# Altium project HV_Module_2W.PrjPCB (part 2 of 2)

## Sheet HV_PWR_STAGE.SchDoc: HV_Module
size 420 x 297 mm; EDA_Number: ARTIQ; Projet: HV_Module; Author: G.Kasprowicz; CompanyName: WUT ISE; DrawnBy: G.Kasprowicz; Organization: WUT ISE; Address1: PW ISE; Address2: Nowowiejska 15/19 00-665 Warsaw; Address3: gkasprow@gmail.com; DocumentNumber: 4; Revision: 1.0; SheetNumber: 4; SheetTotal: 6; ModifiedBy: -; CheckedDate: -; Title2: HV_PWR_Stage; DivGrp: WUT ISE; Designer: G.Kasprowicz; ModifiedDate: -; ProjectName: Sensor Box
Used 2 times, as channels U_HV_PWR_STAGE1, U_HV_PWR_STAGE2. Parts and nets are listed once, with the designators drawn on the sheet.
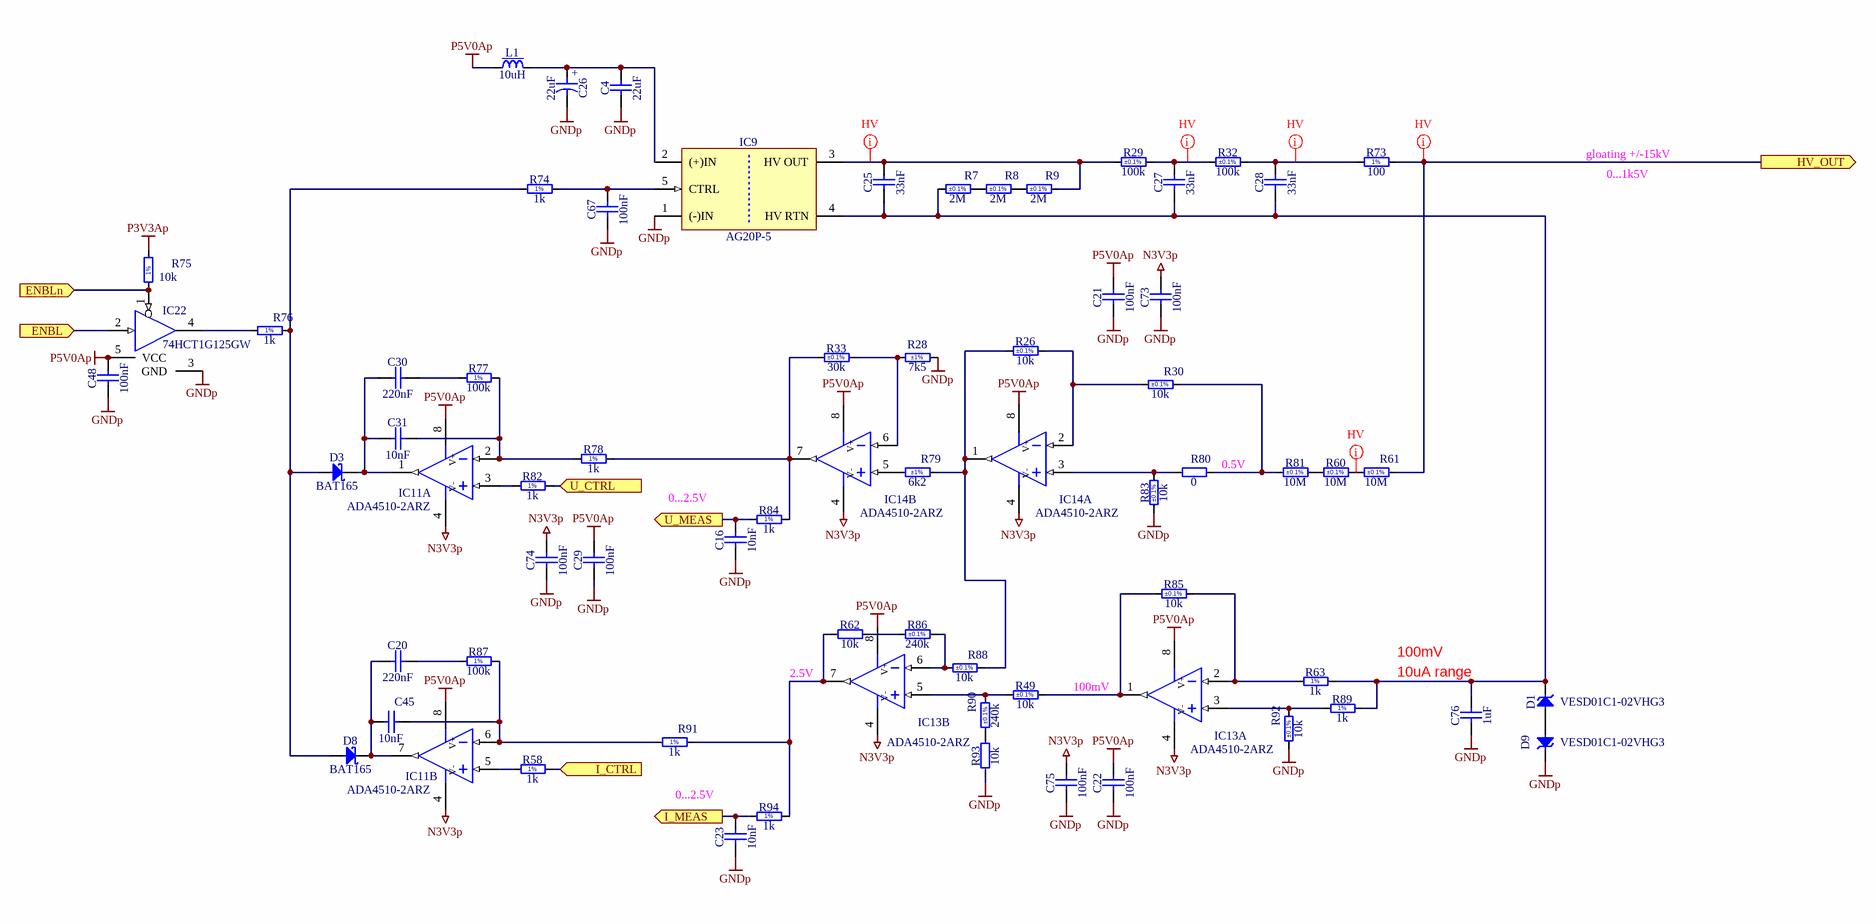
[diagram p3: HV_PWR_STAGE.SchDoc]

### Parts
C4  22uF  [CAPC3216X180N]
C16  10nF  [CAPC1005X55N]
C20  220nF  [CAPC1608X87N]
C21  100nF  [CAPC1005X55N]
C22  100nF  [CAPC1005X55N]
C23  10nF  [CAPC1005X55N]
C25  33nF  [CAPC5764X279N]
C26  22uF  [CAPMP3528X210N]
C27  33nF  [CAPC5764X279N]
C28  33nF  [CAPC5764X279N]
C29  100nF  [CAPC1005X55N]
C30  220nF  [CAPC1608X87N]
C31  10nF  [CAPC1608X87N]
C45  10nF  [CAPC1608X87N]
C48  100nF  [CAPC1005X55N]
C67  100nF  [CAPC1005X55N]
C73  100nF  [CAPC1005X55N]
C74  100nF  [CAPC1005X55N]
C75  100nF  [CAPC1005X55N]
C76  1uF  [CAPC1608X87N]
D1  VESD01C1-02VHG3  [SODFL1608X70N]
D3  BAT165  [SOD2512X110N]
D8  BAT165  [SOD2512X110N]
D9  VESD01C1-02VHG3  [SODFL1608X70N]
IC9  AG20P-5  [DCDC_XPPOWER_AG0-2KV]
IC11  ADA4510-2ARZ  [SOIC127P600X175-8N]  (parts A,B of 2)
IC13  ADA4510-2ARZ  [SOIC127P600X175-8N]  (parts A,B of 2)
IC14  ADA4510-2ARZ  [SOIC127P600X175-8N]  (parts A,B of 2)
IC22  74HCT1G125GW  [SOT65P210X110-5N]
L1  10uH  [IND_BOURNS_PM43]
R7  2M  Tolerance: ±0.1%  [RESC5025X65N]
R8  2M  Tolerance: ±0.1%  [RESC5025X65N]
R9  2M  Tolerance: ±0.1%  [RESC5025X65N]
R26  10k  Tolerance: ±0.1%  [RESC1608X55N]
R28  7k5  Tolerance: ±1%  [RESC1608X55N]
R29  100k  Tolerance: ±0.1%  [RESC3216X50N]
R30  10k  Tolerance: ±0.1%  [RESC1608X55N]
R32  100k  Tolerance: ±0.1%  [RESC3216X50N]
R33  30k  Tolerance: ±0.1%  [RESC1608X55N]
R49  10k  Tolerance: ±0.1%  [RESC1608X55N]
R58  1k  [RESC1005X40N]
R60  10M  Tolerance: ±0.1%  [RESC5025X65N]
R61  10M  Tolerance: ±0.1%  [RESC5025X65N]
R62  10k  [RESC1005X40N]
R63  1k  [RESC1005X40N]
R73  100  [RESC6331X70N]
R74  1k  [RESC1608X55N]
R75  10k  [RESC1005X40N]
R76  1k  [RESC1005X40N]
R77  100k  [RESC1608X55N]
R78  1k  [RESC1005X40N]
R79  6k2  Tolerance: ±1%  [RESC1608X55N]
R80  0  [RESC1005X40N]
R81  10M  Tolerance: ±0.1%  [RESC5025X65N]
R82  1k  [RESC1005X40N]
R83  10k  Tolerance: ±0.1%  [RESC1608X55N]
R84  1k  [RESC1005X40N]
R85  10k  Tolerance: ±0.1%  [RESC1608X55N]
R86  240k  Tolerance: ±0.1%  [RESC1608X55N]
R87  100k  [RESC1608X55N]
R88  10k  Tolerance: ±0.1%  [RESC1608X55N]
R89  1k  [RESC1005X40N]
R90  240k  Tolerance: ±0.1%  [RESC1608X55N]
R91  1k  [RESC1005X40N]
R92  10k  Tolerance: ±0.1%  [RESC1608X55N]
R93  10k  [RESC1005X40N]
R94  1k  [RESC1005X40N]

### Ports
ENBL (in), ENBLn (in), HV_OUT (out), I_CTRL (in), I_MEAS (out), U_CTRL (in), U_MEAS (out)

### Nets
GNDp: C4.1 C16.1 C21.1 C22.1 C23.1 C26.2 C29.1 C48.1 C67.1 C73.1 C74.1 C75.1 C76.1 D9.1(C) IC9.1((-)IN) IC22.3(GND) R28.2 R83.1 R92.1 R93.1
N3V3p: C73.2 C74.2 C75.2 IC11.4(V-) IC13.4(V-) IC14.4(V-)
P3V3Ap: R75.2
P5V0Ap: C21.2 C22.2 C29.2 C48.2 IC11.8(V+) IC13.8(V+) IC14.8(V+) IC22.5(VCC) L1.1
ENBL: IC22.2(IN) ; port ENBL
ENBLn: IC22.1(~{G}) R75.1 ; port ENBLn
HV_OUT: R61.2 R73.2 ; port HV_OUT
I_CTRL: R58.2 ; port I_CTRL
I_MEAS: C23.2 R94.1 ; port I_MEAS
U_CTRL: R82.2 ; port U_CTRL
U_MEAS: C16.2 R84.1 ; port U_MEAS
NetC4_2: C4.2 C26.1 IC9.2((+)IN) L1.2
NetC20_1: C20.1 C45.1 D8.1(C) IC11.7(OUT)
NetC20_2: C20.2 R87.1
NetC25_1: C25.1 C27.1 C28.1 C76.2 D1.1(C) IC9.4(HV_RTN) R7.1 R63.2 R89.2
NetC25_2: C25.2 IC9.3(HV_OUT) R9.2 R29.1
NetC27_2: C27.2 R29.2 R32.1
NetC28_2: C28.2 R32.2 R73.1
NetC30_1: C30.1 C31.1 D3.1(C) IC11.1(OUT)
NetC30_2: C30.2 R77.1
NetC31_2: C31.2 IC11.2(IN-) R77.2 R78.1
NetC45_2: C45.2 IC11.6(IN-) R87.2 R91.1
NetC67_2: C67.2 IC9.5(CTRL) R74.2
NetD1_2: D1.2(A) D9.2(A)
NetD3_2: D3.2(A) D8.2(A) R74.1 R76.2
NetIC11_3: IC11.3(IN+) R82.1
NetIC11_5: IC11.5(IN+) R58.1
NetIC13_1: IC13.1(OUT) R49.2 R85.1
NetIC13_2: IC13.2(IN-) R63.1 R85.2
NetIC13_3: IC13.3(IN+) R89.1 R92.2
NetIC13_5: IC13.5(IN+) R49.1 R90.2
NetIC13_6: IC13.6(IN-) R86.2 R88.1
NetIC13_7: IC13.7(OUT) R62.1 R91.2 R94.2
NetIC14_1: IC14.1(OUT) R26.1 R79.2 R88.2
NetIC14_2: IC14.2(IN-) R26.2 R30.1
NetIC14_3: IC14.3(IN+) R80.1 R83.2
NetIC14_5: IC14.5(IN+) R79.1
NetIC14_6: IC14.6(IN-) R28.1 R33.2
NetIC14_7: IC14.7(OUT) R33.1 R78.2 R84.2
NetIC22_4: IC22.4(OUT) R76.1
NetR7_2: R7.2 R8.1
NetR8_2: R8.2 R9.1
NetR30_2: R30.2 R80.2 R81.1
NetR60_1: R60.1 R81.2
NetR60_2: R60.2 R61.1
NetR62_2: R62.2 R86.1
NetR90_1: R90.1 R93.2

### Channels
U_HV_PWR_STAGE1: designators end in A; ports ENBL=ENBL ENBLn=ENBLn1 HV_OUT=HV_OUT I_CTRL=DAC_I I_MEAS=ADC_I U_CTRL=DAC_U U_MEAS=U_meas1
U_HV_PWR_STAGE2: designators end in B; ports ENBL=ENBL ENBLn=ENBLn2 HV_OUT=HV_OUT I_CTRL=DAC_I I_MEAS=ADC_I U_CTRL=DAC_U U_MEAS=U_meas2

### Layout directives
net class HV: HV_OUT, NetC25A_2, NetC27A_2, NetC28A_2, NetR60A_2

### Notes on the sheet
- gloating +/-15kV
- 0...1k5V
- (near R80) 0.5V
- 0...2.5V
- 2.5V
- 100mV
- (near C76) 10uA range
- Project/Equipment
- Document
- Designer
- Drawn by
- Check.by
- Copyright WUT ISE 2020.
  This documentation describes Open Hardware and is licensed under the CERN OHL v.1.2. You may redistribute and modify this documentation under the terms of the CERN OHL v.1.2. (http://ohwr.org/CERNOHL). This documentation is distributed WITHOUT ANY EXPRESS OR IMPLIED WARRANTY, INCLUDING OF MERCHANTABILITY, SATISFACTORY QUALITY AND FITNESS FOR A PARTICULAR PURPOSE. Please see the CERN OHL v.1.2 for applicable conditions.
- Contact
- File
- Last Mod.
- Print Date
- Sheet
- Size
- A3
- of
- Rev
- (in symbol CTE3528-21_22UF_20V_10%) +
- (in symbol R0402_1K_1%_0.0625W_100PPM) 1%
- (in symbol R0402_10K_1%_0.0625W_100PPM) 1%
- (in symbol R0603_1K_1%_0.1W_100PPM) 1%
- (in symbol R0603_100K_1%_0.1W_100PPM) 1%
- (in symbol R2512_100R_1%_1.5W_100PPM_VISHAY_CRCW-HP e3) 1%

### Library data of the parts
C4 = CC1206_22UF_25V_20%_X5R: Non-polarised capacitor; Part Description: SMD Multilayer Chip Ceramic Capacitor; Manufacturer: GENERIC; Manufacturer1 Part Number: C3216X5R1E226M160AB; Voltage: 25V; TC: X5R; Tolerance: ±20%; Part Number: CC1206_22UF_25V_20%_X5R; Component Kind: Standard; Component Type: Standard; Pin Count: 2; Value: 22uF; Status: None; Manufacturer Part Number: CC1206_22UF_25V_20%_X5R; Case: 1206; Mounted: Yes; Socket: No; SMD: Yes; Sense: No; Manufacturer1 Example: TDK; Manufacturer1 ComponentHeight: 1.8mm; HelpURL: \\cern.ch\dfs\Applications\Altium\Datasheets\CC1206_X5R_TDK_C.pdf; Author: CERN DEM WB; CreateDate: 25/07/2018; LatestRevisionDate: 25/07/2018
C16 C23 = CC0402_10NF_25V_10%_X7R: Non-polarised capacitor; Part Description: SMD Multilayer Chip Ceramic Capacitor; Manufacturer: GENERIC; Manufacturer1 Part Number: C1005X7R1E103K050; Voltage: 25V; TC: X7R; Tolerance: ±10%; Part Number: CC0402_10NF_25V_10%_X7R; Component Kind: Standard; Component Type: Standard; Pin Count: 2; Value: 10nF; Status: Preferred; Manufacturer Part Number: CC0402_10NF_25V_10%_X7R; Case: 0402; Mounted: Yes; Socket: No; SMD: Yes; Sense: No; Manufacturer1 Example: TDK; Manufacturer1 ComponentHeight: 0.55mm; HelpURL: \\cern.ch\dfs\Applications\Altium\Datasheets\CC0402_X7R_TDK_C.pdf; Author: CERN DEM JLC; CreateDate: 25.10.2012; LatestRevisionDate: 25.10.2012
C20 C30 = CC0603_220NF_10V_10%_X7R: Non-polarised capacitor; Part Description: SMD Multilayer Chip Ceramic Capacitor; Manufacturer: GENERIC; Manufacturer1 Part Number: 223824615654 or CC0603KRX7R6BB224; Voltage: 10V; TC: X7R; Tolerance: ±10%; Part Number: CC0603_220NF_10V_10%_X7R; Component Kind: Standard; Component Type: Standard; Pin Count: 2; Value: 220nF; Status: Preferred; Manufacturer Part Number: CC0603_220NF_10V_10%_X7R; Case: 0603; Mounted: Yes; Socket: No; SMD: Yes; Sense: No; Manufacturer1 Example: YAGEO PHYCOMP; Manufacturer1 ComponentHeight: 0.9mm; HelpURL: \\cern.ch\dfs\Applications\Altium\Datasheets\CC0603_X7R_PHYCOMP.pdf; Author: CERN DEM JLC; CreateDate: 2012-10-25; LatestRevisionDate: 2012-10-25
C21 C22 C29 C48 C67 C73-C75 = CC0402_100NF_16V_10%_X7R: Non-polarised capacitor; Part Description: SMD Multilayer Chip Ceramic Capacitor; Manufacturer: GENERIC; Manufacturer1 Part Number: GRM155R71C104KA88D; Voltage: 16V; TC: X7R; Tolerance: ±10%; Part Number: CC0402_100NF_16V_10%_X7R; Component Kind: Standard; Component Type: Standard; Pin Count: 2; Value: 100nF; Status: Not Recommended; Manufacturer Part Number: CC0402_100NF_16V_10%_X7R; Case: 0402; Mounted: Yes; Socket: No; SMD: Yes; Sense: No; Manufacturer1 Example: MURATA; Manufacturer1 ComponentHeight: 0.55mm; HelpURL: \\cern.ch\dfs\Applications\Altium\Datasheets\CC0402_X7R_MURATA_GRM.pdf; Author: CERN DEM JLC
  C21 C22 C67: CreateDate: 2013-12-05; LatestRevisionDate: 2007-12-03
  C29 C48 C73-C75: CreateDate: 05.12.2013; LatestRevisionDate: 03.12.2007
C25 C27 C28 = CC2225_33NF_2KV_10%_X7R: Non-polarised capacitor; Part Description: High Voltage MLC Chip Capacitor; Manufacturer: GENERIC; Manufacturer1 Part Number: 2225GC333KAT1A; Voltage: 2KV; TC: X7R; Tolerance: ±10%; Part Number: CC2225_33NF_2KV_10%_X7R; Component Kind: Standard; Component Type: Standard; Pin Count: 2; Value: 33nF; Status: None; Manufacturer Part Number: CC2225_33NF_2KV_10%_X7R; Case: 2225; Mounted: Yes; Socket: No; SMD: Yes; Sense: No; Manufacturer1 Example: AVX; Manufacturer1 ComponentHeight: 2.54mm; HelpURL: \\cern.ch\dfs\Applications\Altium\Datasheets\CC2225_X7R_AVX_HV-MLC.pdf; Author: CERN DEM JMW; CreateDate: 13.07.2015; LatestRevisionDate: 13.07.2015
C26 = CTE3528-21_22UF_20V_10%: Polarised capacitor; Part Description: Solid Tantalum Chip Capacitor; Manufacturer: GENERIC; Manufacturer1 Part Number: TAJB226K020R; Voltage: 20V; Tolerance: ±10%; Part Number: CTE3528-21_22UF_20V_10%; Component Kind: Standard; Component Type: Standard; Pin Count: 2; Value: 22uF; Status: Preferred; Manufacturer Part Number: CTE3528-21_22UF_20V_10%; Case: B; Mounted: Yes; Socket: No; SMD: Yes; Sense: No; Manufacturer1 Example: AVX; Manufacturer1 ComponentHeight: 2.1mm; HelpURL: \\cern.ch\dfs\Applications\Altium\Datasheets\CTE_AVX_TAJ.pdf; Author: CERN DEM JLC; CreateDate: 03/12/2007; LatestRevisionDate: 03/12/2007
C31 C45 = CC0603_10NF_50V_5%_C0G: Non-polarised capacitor; Part Description: SMD Multilayer Chip Ceramic Capacitor; Manufacturer: GENERIC; Manufacturer1 Part Number: C1608C0G1H103J080AA; Voltage: 50V; TC: C0G/NP0; Tolerance: ±5%; Part Number: CC0603_10NF_50V_5%_C0G; Component Kind: Standard; Component Type: Standard; Pin Count: 2; Value: 10nF; Status: Preferred; Manufacturer Part Number: CC0603_10NF_50V_5%_C0G; Case: 0603; Mounted: Yes; Socket: No; SMD: Yes; Sense: No; Manufacturer1 Example: TDK; Manufacturer1 ComponentHeight: 0.9mm; HelpURL: \\cern.ch\dfs\Applications\Altium\Datasheets\CC0603_C0G_TDK_C.pdf; Author: CERN DEM JLC; CreateDate: 2014-12-10; LatestRevisionDate: 2014-12-10
C76 = CC0603_1UF_16V_10%_X7R: Non-polarised capacitor; Part Description: SMD Multilayer Chip Ceramic Capacitor; Manufacturer: GENERIC; Manufacturer1 Part Number: 223878615663; Voltage: 16V; TC: X7R; Tolerance: ±10%; Part Number: CC0603_1UF_16V_10%_X7R; Component Kind: Standard; Component Type: Standard; Pin Count: 2; Value: 1uF; Status: None; Manufacturer Part Number: CC0603_1UF_16V_10%_X7R; Case: 0603; Mounted: Yes; Socket: No; SMD: Yes; Sense: No; Manufacturer1 Example: YAGEO PHYCOMP; Manufacturer1 ComponentHeight: 0.9mm; HelpURL: \\cern.ch\dfs\Applications\Altium\Datasheets\CC0603_X7R_PHYCOMP.pdf; Author: CERN DEM JLC; CreateDate: 03.12.2007; LatestRevisionDate: 17.04.2015
D1 D9 = VESD01C1-02VHG3: Transient Voltage Suppressor Diode (Uni-Directional); Part Description: Single-Line ESD-Protection (30kV) Diode; Manufacturer: VISHAY SEMICONDUCTORS; Voltage: 1V; Power: 100W; PressFit: No; Bonding: No; Part Number: VESD01C1-02VHG3; Component Kind: Standard; Component Type: Standard; Device: VESD01C1-02VHG3; PackageDescription: SODFL (SOD-523) Diode; 1.20mm W X 0.80mm L X 0.70mm H body, IPC Medium Density; Manufacturer Part Number: VESD01C1-02VHG3; Pin Count: 2; Case: SOD-523; Mounted: Yes; Socket: No; SMD: Yes; Sense: No; ComponentHeight: 0.7mm; HelpURL: \\cern.ch\dfs\Applications\Altium\Datasheets\VESD01C1-02VHG3.pdf; Author: CERN DEM BC; CreateDate: 19.05.2020; LatestRevisionDate: 19.05.2020
D3 D8 = BAT165: Schottky Diode; Part Description: Medium Power AF Schottky Diode; Manufacturer: INFINEON; Voltage: 40V; Power: 750mA; PressFit: No; Bonding: No; Part Number: BAT165; Component Kind: Standard; Component Type: Standard; Device: BAT165; PackageDescription: Small Outline Diode (SOD-323), 1.70mm W X 1.25mm L X 1.10mm H body,  IPC Medium Density; Manufacturer Part Number: BAT165; Pin Count: 2; Case: SOD-323; Mounted: Yes; Socket: No; SMD: Yes; Sense: No; ComponentHeight: 1.1mm; HelpURL: \\cern.ch\dfs\Applications\Altium\Datasheets\BAT165.pdf; Author: CERN DEM JLC; CreateDate: 12.11.2014; LatestRevisionDate: 12.11.2014
IC9 = AG20P-5: XP POWER, AG Series, DC/HVDC Converter; Part Description: 5VDC to 0-2kVDC, Iout (max) 0.5mA, 1W DC-HVDC Converter; PressFit: No; Bonding: No; Part Number: AG20P-5; Component Kind: Standard; Component Type: Standard; Device: AG20P-5; PackageDescription: AG Series, DC/HVDC Converter, Body W 11.43mm x L 23.37mm x H 6.35mm; Manufacturer: XP POWER; Manufacturer Part Number: AG20P-5; Pin Count: 5; Mounted: Yes; Socket: No; SMD: Yes; Sense: No; ComponentHeight: 3.3mm; HelpURL: \\cern.ch\dfs\Applications\Altium\Datasheets\XPPOWER_AG-Series.pdf; Author: CERN DEM BC; CreateDate: 18.09.2020; LatestRevisionDate: 18.09.2020
IC11 IC13 IC14 = OA_ADA4510-2ARZ: Precision, 40 V, ±70 nV/°C, Rail-to-Rail Input and Output Op Amp with DigiTrim; Part Description: 40V, EMI Enhanced, Zero Drift, Ultralow Noise, Dual Rail-to-Rail Output Operational Amplifier; Manufacturer: ANALOG DEVICES; PressFit: No; Bonding: No; Part Number: ADA4510-2ARZ; Component Kind: Standard; Component Type: Standard; Device: ADA4510-2ARZ; PackageDescription: SOIC 8, Pitch 1.27mm - Body 4x5mm, IPC Medium Density; Manufacturer Part Number: ADA4510-2ARZ; Pin Count: 8; Case: SOIC8; Mounted: Yes; Socket: No; SMD: Yes; Sense: No; ComponentHeight: 1.75mm; Author: GK; HelpURL: \\cern.ch\dfs\Applications\Altium\Datasheets\ADA4522-X.pdf; CreateDate: 05.01.2023; LatestRevisionDate: 05.01.2023
IC22 = 74HCT1G125GW: Single Bus Buffer Gate With 3-State Output; Part Description: Bus Buffer/Line Driver 3-State; Manufacturer: NEXPERIA; PressFit: No; Bonding: No; Part Number: 74HCT1G125GW; Component Kind: Standard; Component Type: Standard; Device: 74HCT1G125GW; PackageDescription: SOT353, SC70-5, 0.65mm Pitch; 5 Pin, 1.25mm W X 2.00mm L X 1.10mm H body, IPC Medium Density; Manufacturer Part Number: 74HCT1G125GW; Pin Count: 5; Case: SOT353; Mounted: Yes; Socket: No; SMD: Yes; Sense: No; ComponentHeight: 1.1mm; Author: CERN DEM JMW; HelpURL: \\cern.ch\dfs\Applications\Altium\Datasheets\74HCT1G125GW.pdf; CreateDate: 06.08.2020; LatestRevisionDate: 06.08.2020
L1 = IND_10UH_20%_BOURNS_PM43: Inductor With Core; Part Description: SMD Power Inductor; Manufacturer: BOURNS; Manufacturer Part Number: PM43-100M-RC; Power: 1.15A; Resistance: 0.18R; Tolerance: ±20%; Part Number: IND_10UH_20%_BOURNS_PM43; Component Kind: Standard; Component Type: Standard; Pin Count: 2; Value: 10uH; Status: None; Mounted: Yes; Socket: No; SMD: Yes; Sense: No; ComponentHeight: 3.5mm; HelpURL: \\cern.ch\dfs\Applications\Altium\Datasheets\IND_BOURNS_PM43.pdf; Author: CERN DEM JLC; CreateDate: 17/05/2011; LatestRevisionDate: 17/05/2011
R7-R9 = R1210_2M0_0.1%_1/3W_25ppm: RES, HV, 2010, 2 Mohm, 0.1%, 25 ppm, 1W; Part Description: Thick Film Chip Resistor; Manufacturer: Vishay Dale; Manufacturer Part Number: TNPV12102M00BEEA; Power: 1/3W; TC: ±25ppm/°C; PressFit: No; Part Number: R1210_2M0_0.1%_1/3W_25ppm; Component Kind: Standard; Component Type: Standard; Pin Count: 2; Value: 2M; Status: None; Case: 2010; Mounted: Yes; Sense: No; Socket: No; SMD: Yes; Manufacturer1 ComponentHeight: 0.65mm; HelpURL: \\cern.ch\dfs\Applications\Altium\Datasheets\R2010_WELWYN_LHVC.pdf; Author: GK; CreateDate: 26.02.2015; LatestRevisionDate: 26.02.2015
R26 R30 R49 R83 R85 R88 R92 = R0603_10K_0.1%_0.063W_10PPM: Resistor - 0.1%; Part Description: Thin Film Chip Resistor; Manufacturer: GENERIC; Manufacturer1 Part Number: RN73C1J10KBTDF; Power: 0.063W; TC: ±10ppm; PressFit: No; Part Number: R0603_10K_0.1%_0.063W_10PPM; Component Kind: Standard; Component Type: Standard; Pin Count: 2; Value: 10k; Status: Not Recommended; Manufacturer Part Number: R0603_10K_0.1%_0.063W_10PPM; Case: 0603; Mounted: Yes; Sense: No; Socket: No; SMD: Yes; Manufacturer1 Example: TYCO HOLSWORTHY; Manufacturer1 ComponentHeight: 0.5mm; HelpURL: \\cern.ch\dfs\Applications\Altium\Datasheets\R0603_Tyco_RN73.pdf; Author: CERN DEM JLC; CreateDate: 03.12.2007; LatestRevisionDate: 13.03.2008
R28 = R0603_7K5_1%_0.1W_100PPM: Resistor - 1%; Part Description: General Purpose Thick Film Chip Resistor; Manufacturer: GENERIC; Manufacturer1 Part Number: NRC06F7501TRF; Power: 0.1W; TC: ±100ppm/°C; PressFit: No; Part Number: R0603_7K5_1%_0.1W_100PPM; Component Kind: Standard; Component Type: Standard; Pin Count: 2; Value: 7k5; Status: Preferred; Manufacturer Part Number: R0603_7K5_1%_0.1W_100PPM; Case: 0603; Mounted: Yes; Sense: No; Socket: No; SMD: Yes; Manufacturer1 Example: NIC COMPONENT; Manufacturer1 ComponentHeight: 0.55mm; HelpURL: \\cern.ch\dfs\Applications\Altium\Datasheets\R0603_NIC_NRC.pdf; Author: CERN DEM JLC; CreateDate: 03.12.2007; LatestRevisionDate: 13.03.2008
R29 R32 = R1206_100K_0.1%_0.4W_25PPM_VISHAY_PAT: Resistor - 0.1%; Part Description: Precision Automotive Thin Film Chip Resistors 2kV ESD Rating; Manufacturer: VISHAY DALE THIN FILM; Manufacturer Part Number: PAT1206E1003BS; Power: 0.4W; TC: ±25ppm/°C; PressFit: No; Part Number: R1206_100K_0.1%_0.4W_25PPM_VISHAY_PAT; Component Kind: Standard; Component Type: Standard; Pin Count: 2; Value: 100k; Status: None; Case: 1206; Mounted: Yes; Sense: No; Socket: No; SMD: Yes; ComponentHeight: 0.5mm; HelpURL: \\cern.ch\dfs\Applications\Altium\Datasheets\R1206_VISHAY_PAT.pdf; Author: CERN DEM MR; CreateDate: 19.07.2016; LatestRevisionDate: 19.07.2016
R33 = R0603_30K_0.1%_0.063W_25PPM: Resistor - 0.1%; Part Description: Thin Film Chip Resistor; Manufacturer: GENERIC; Manufacturer1 Part Number: CPF0603B30KE1; Power: 0.063W; TC: ±25ppm; PressFit: No; Part Number: R0603_30K_0.1%_0.063W_25PPM; Component Kind: Standard; Component Type: Standard; Pin Count: 2; Value: 30k; Status: Not Recommended; Manufacturer Part Number: R0603_30K_0.1%_0.063W_25PPM; Case: 0603; Mounted: Yes; Sense: No; Socket: No; SMD: Yes; Manufacturer1 Example: TE CONNECTIVITY; Manufacturer1 ComponentHeight: 0.55mm; HelpURL: \\cern.ch\dfs\Applications\Altium\Datasheets\R0603_TYCO_CPF.pdf; Author: CERN DEM JMW; CreateDate: 28.07.2021; LatestRevisionDate: 28.07.2021
R58 R63 R76 R78 R82 R84 R89 R91 R94 = R0402_1K_1%_0.0625W_100PPM: Resistor - 1%; Part Description: General Purpose Thick Film Chip Resistor; Manufacturer: GENERIC; Manufacturer1 Part Number: 232270671002L; TC: ±100ppm/°C; Part Number: R0402_1K_1%_0.0625W_100PPM; Component Kind: Standard; Component Type: Standard; Pin Count: 2; Value: 1k; Status: Not recommended; Power: 0.0625W; Tolerance: ±1%; Manufacturer Part Number: R0402_1K_1%_0.0625W_100PPM; Case: 0402; Mounted: Yes; Sense: No; Socket: No; SMD: Yes; Manufacturer1 Example: YAGEO PHYCOMP; Manufacturer1 ComponentHeight: 0.4mm; HelpURL: \\cern.ch\dfs\Applications\Altium\Datasheets\R0402_Phycomp_RC0402.pdf; Author: CERN DEM JLC; CreateDate: 2007-12-03; LatestRevisionDate: 2012-10-17
R60 R61 R81 = R1210_1M0_0.1%_1W_25ppm_HVCB2010BDE10M0: RES, HV, 2010, 10 Mohm, 0.1%, 25 ppm, 1W; Part Description: Thick Film Chip Resistor; Manufacturer: Stackpole Electronics; TC: ±25ppm/°C; PressFit: No; Part Number: R1210_1M0_0.1%_1W_25ppm_HVCB2010BDE10M0; Component Kind: Standard; Component Type: Standard; Pin Count: 2; Value: 10M; Status: None; Power: 1W; Manufacturer Part Number: HVCB2010BDE10M0; Case: 2010; Mounted: Yes; Sense: No; Socket: No; SMD: Yes; Manufacturer1 ComponentHeight: 0.65mm; HelpURL: \\cern.ch\dfs\Applications\Altium\Datasheets\R2010_WELWYN_LHVC.pdf; Author: GK; CreateDate: 26.02.2015; LatestRevisionDate: 26.02.2015
R62 R93 = R0402_10K_1%_0.0625W_100PPM: Resistor - 1%; Part Description: General Purpose Thick Film Chip Resistor; Manufacturer: GENERIC; Manufacturer1 Part Number: 232270671003L; TC: ±100ppm/°C; PressFit: No; Part Number: R0402_10K_1%_0.0625W_100PPM; Component Kind: Standard; Component Type: Standard; Pin Count: 2; Value: 10k; Status: Not Recommended; Power: 0.0625W; Tolerance: ±1%; Manufacturer Part Number: R0402_10K_1%_0.0625W_100PPM; Case: 0402; Mounted: Yes; Sense: No; Socket: No; SMD: Yes; Manufacturer1 Example: YAGEO PHYCOMP; Manufacturer1 ComponentHeight: 0.4mm; HelpURL: \\cern.ch\dfs\Applications\Altium\Datasheets\R0402_Phycomp_RC0402.pdf; Author: CERN DEM JLC; CreateDate: 03.12.2007; LatestRevisionDate: 17.10.2012
R73 = R2512_100R_1%_1.5W_100PPM_VISHAY_CRCW-HP e3: Resistor - 1%; Part Description: Pulse Proof, High Power Thick Film Chip Resistor; Manufacturer: VISHAY DRALORIC; Manufacturer Part Number: CRCW2512100RFKEHHP; Power: 1.5W; TC: ±100ppm/°C; Voltage: 500V; Part Number: R2512_100R_1%_1.5W_100PPM_VISHAY_CRCW-HP e3; Component Kind: Standard; Component Type: Standard; Pin Count: 2; Value: 100; Status: None; Tolerance: ±1%; Case: 2512; Mounted: Yes; Sense: No; Socket: No; SMD: Yes; ComponentHeight: 0.7mm; HelpURL: \\cern.ch\dfs\Applications\Altium\Datasheets\R2512_VISHAY_CRCW-HP e3.pdf; Author: CERN DEM JLC; CreateDate: 2013-05-21; LatestRevisionDate: 2013-05-21
R74 = R0603_1K_1%_0.1W_100PPM: Resistor - 1%; Part Description: General Purpose Thick Film Chip Resistor; Manufacturer: GENERIC; Manufacturer1 Part Number: NRC06F1001TRF; Power: 0.1W; TC: ±100ppm/°C; PressFit: No; Part Number: R0603_1K_1%_0.1W_100PPM; Component Kind: Standard; Component Type: Standard; Pin Count: 2; Value: 1k; Status: Preferred; Tolerance: ±1%; Manufacturer Part Number: R0603_1K_1%_0.1W_100PPM; Case: 0603; Mounted: Yes; Sense: No; Socket: No; SMD: Yes; Manufacturer1 Example: NIC COMPONENT; Manufacturer1 ComponentHeight: 0.55mm; HelpURL: \\cern.ch\dfs\Applications\Altium\Datasheets\R0603_NIC_NRC.pdf; Author: CERN DEM JLC; CreateDate: 03/12/2007; LatestRevisionDate: 13/03/2008
R75 = R0402_10K_1%_0.0625W_100PPM: as R107 on sheet Isolators_HV; Part Number: R0402_10K_1%_0.0625W_100PPM; Component Kind: Standard; Component Type: Standard; Pin Count: 2; Value: 10k; Status: Not recommended; Power: 0.0625W; Tolerance: ±1%; Manufacturer Part Number: R0402_10K_1%_0.0625W_100PPM; Case: 0402; Mounted: Yes; Sense: No; Socket: No; SMD: Yes; Manufacturer1 Example: YAGEO PHYCOMP; Manufacturer1 ComponentHeight: 0.4mm; HelpURL: \\cern.ch\dfs\Applications\Altium\Datasheets\R0402_Phycomp_RC0402.pdf; Author: CERN DEM JLC; CreateDate: 2007-12-03; LatestRevisionDate: 2012-10-17
R77 R87 = R0603_100K_1%_0.1W_100PPM: Resistor - 1%; Part Description: General Purpose Thick Film Chip Resistor; Manufacturer: GENERIC; Manufacturer1 Part Number: NRC06F1003TRF; Power: 0.1W; TC: ±100ppm/°C; Part Number: R0603_100K_1%_0.1W_100PPM; Component Kind: Standard; Component Type: Standard; Pin Count: 2; Value: 100k; Status: Preferred; Tolerance: ±1%; Manufacturer Part Number: R0603_100K_1%_0.1W_100PPM; Case: 0603; Mounted: Yes; Sense: No; Socket: No; SMD: Yes; Manufacturer1 Example: NIC COMPONENT; Manufacturer1 ComponentHeight: 0.55mm; HelpURL: \\cern.ch\dfs\Applications\Altium\Datasheets\R0603_NIC_NRC.pdf; Author: CERN DEM JLC; CreateDate: 2007-12-03; LatestRevisionDate: 2008-03-13
R79 = R0603_6k2_1%_0.1W_100PPM: Resistor - 1%; Part Description: General Purpose Thick Film Chip Resistor; Manufacturer: GENERIC; Manufacturer1 Part Number: NRC06F6201TRF; Power: 0.1W; TC: ±100ppm/°C; PressFit: No; Part Number: R0603_6K2_1%_0.1W_100PPM; Component Kind: Standard; Component Type: Standard; Pin Count: 2; Value: 6k2; Status: Preferred; Manufacturer Part Number: R0603_6K2_1%_0.1W_100PPM; Case: 0603; Mounted: Yes; Sense: No; Socket: No; SMD: Yes; Manufacturer1 Example: NIC COMPONENT; Manufacturer1 ComponentHeight: 0.55mm; HelpURL: \\cern.ch\dfs\Applications\Altium\Datasheets\R0603_NIC_NRC.pdf; Author: CERN DEM JLC; CreateDate: 03.12.2007; LatestRevisionDate: 13.03.2008
R80 = R0402_0R_JUMPER: Resistor; Part Description: 1A (0.05R Max DC Resistance) Zero Ohm Jumper; Manufacturer: GENERIC; Manufacturer1 Part Number: 232270591001L; PressFit: No; Part Number: R0402_0R_JUMPER; Component Kind: Standard; Component Type: Standard; Pin Count: 2; Value: 0; Status: Not Recommended; Manufacturer Part Number: R0402_0R_JUMPER; Case: 0402; Mounted: Yes; Sense: No; Socket: No; SMD: Yes; Manufacturer1 Example: YAGEO PHYCOMP; Manufacturer1 ComponentHeight: 0.4mm; HelpURL: \\cern.ch\dfs\Applications\Altium\Datasheets\R0402_Phycomp_RC0402.pdf; Author: CERN DEM JLC; CreateDate: 03.12.2007; LatestRevisionDate: 17.10.2012
R86 R90 = R0603_240K_0.1%_0.063W_10PPM: Resistor - 0.1%; Part Description: Thin Film Chip Resistor; Manufacturer: GENERIC; Manufacturer1 Part Number: RN73C1J241KBTDF; Power: 0.063W; TC: ±10ppm; PressFit: No; Part Number: R0603_240K_0.1%_0.063W_10PPM; Component Kind: Standard; Component Type: Standard; Pin Count: 2; Value: 240k; Status: Not Recommended; Manufacturer Part Number: R0603_240K_0.1%_0.063W_10PPM; Case: 0603; Mounted: Yes; Sense: No; Socket: No; SMD: Yes; Manufacturer1 Example: TYCO HOLSWORTHY; Manufacturer1 ComponentHeight: 0.5mm; HelpURL: \\cern.ch\dfs\Applications\Altium\Datasheets\R0603_Tyco_RN73.pdf; Author: CERN DEM BC; CreateDate: 28.10.2021; LatestRevisionDate: 28.10.2021

## Sheet Supply_5V_ISOL.SchDoc: HV_Module
size 420 x 297 mm; EDA_Number: ARTIQ; Projet: HV_Module; Author: G.Kasprowicz; CompanyName: WUT ISE; DrawnBy: G.Kasprowicz; Organization: WUT ISE; Address1: PW ISE; Address2: Nowowiejska 15/19 00-665 Warsaw; Address3: gkasprow@gmail.com; DocumentNumber: 5; Revision: 1.0; SheetNumber: 5; SheetTotal: 6; ModifiedBy: -; CheckedDate: -; Title2: Supply_5V_ISOL; DivGrp: WUT ISE; Designer: G.Kasprowicz; ModifiedDate: -; ProjectName: Sensor Box
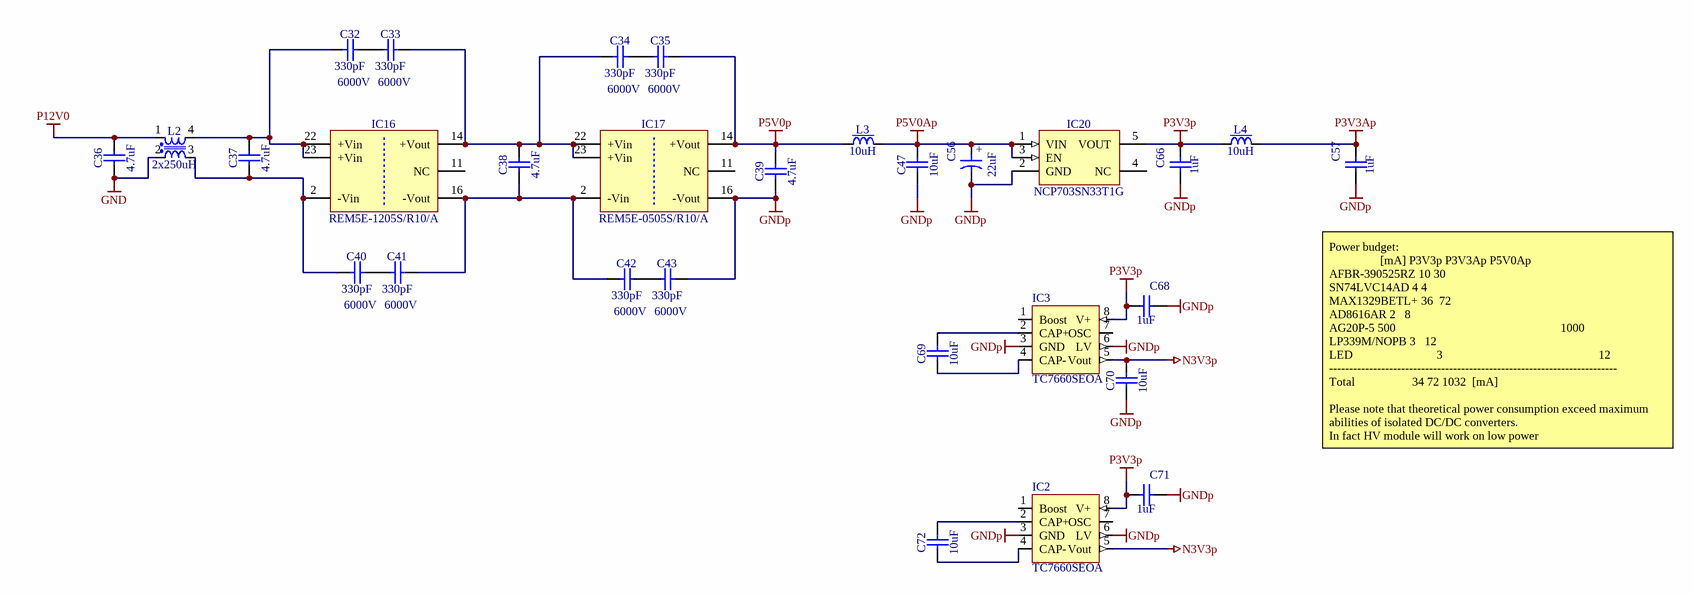
[diagram p4: Supply_5V_ISOL.SchDoc]

### Parts
C32  330pF  Voltage: 6000V  [CAPC4620X220N]
C33  330pF  Voltage: 6000V  [CAPC4620X220N]
C34  330pF  Voltage: 6000V  [CAPC4620X220N]
C35  330pF  Voltage: 6000V  [CAPC4620X220N]
C36  4.7uF  [CAPC2012X145N]
C37  4.7uF  [CAPC2012X145N]
C38  4.7uF  [CAPC2012X145N]
C39  4.7uF  [CAPC2012X145N]
C40  330pF  Voltage: 6000V  [CAPC4620X220N]
C41  330pF  Voltage: 6000V  [CAPC4620X220N]
C42  330pF  Voltage: 6000V  [CAPC4620X220N]
C43  330pF  Voltage: 6000V  [CAPC4620X220N]
C47  10uF  [CAPC1608X80N]
C56  22uF  [CAPMP3528X210N]
C57  1uF  [CAPC1005X55N]
C66  1uF  [CAPC1005X55N]
C68  1uF  [CAPC1005X55N]
C69  10uF  [CAPC1608X80N]
C70  10uF  [CAPC1608X80N]
C71  1uF  [CAPC1005X55N]
C72  10uF  [CAPC1608X80N]
IC2  TC7660SEOA  [SO-8]
IC3  TC7660SEOA  [SO-8]
IC16  REM5E-1205S/R10/A  [DCDC_RECOM_REM5E-XXXXS]
IC17  REM5E-0505S/R10/A  [DCDC_RECOM_REM5E-XXXXS]
IC20  NCP703SN33T1G  [SOT95P275X110-5N]
L2  2x250uH  [IND_WURTH_WE-SL2]
L3  10uH  [IND_BOURNS_PM43]
L4  10uH  [IND_BOURNS_PM43]

### Nets
GND: C36.1 L2.2
GNDp: C39.1 C43.2 C47.1 C56.2 C57.1 C66.1 C68.2 C70.1 C71.2 IC2.3(GND) IC2.6(LV) IC3.3(GND) IC3.6(LV) IC17.16(-Vout) IC20.2(GND)
N3V3p: C70.2 IC2.5(Vout) IC3.5(Vout)
P3V3Ap: C57.2 L4.2
P3V3p: C66.2 C68.1 C71.1 IC2.8(V+) IC3.8(V+) IC20.5(VOUT) L4.1
P5V0Ap: C47.2 C56.1 IC20.1(VIN) IC20.3(EN) L3.2
P5V0p: C35.2 C39.2 IC17.14(+Vout) L3.1
P12V0: C36.2 L2.1
NetC32_1: C32.1 C37.2 IC16.22(+Vin) IC16.23(+Vin) L2.4
NetC32_2: C32.2 C33.1
NetC33_2: C33.2 C34.1 C38.2 IC16.14(+Vout) IC17.22(+Vin) IC17.23(+Vin)
NetC34_2: C34.2 C35.1
NetC37_1: C37.1 C40.1 IC16.2(-Vin) L2.3
NetC38_1: C38.1 C41.2 C42.1 IC16.16(-Vout) IC17.2(-Vin)
NetC40_2: C40.2 C41.1
NetC42_2: C42.2 C43.1
NetC69_1: C69.1 IC3.4(CAP-)
NetC69_2: C69.2 IC3.2(CAP+)
NetC72_1: C72.1 IC2.4(CAP-)
NetC72_2: C72.2 IC2.2(CAP+)

Not connected (* = marked no-connect by the designer): IC2 1(Boost) 7(OSC); IC3 1(Boost) 7(OSC); IC16 11(NC); IC17 11(NC); IC20 4(NC)

### Notes on the sheet
- Power budget:
  [mA]	P3V3p	P3V3Ap	P5V0Ap
  AFBR-390525RZ	10	30
  SN74LVC14AD	4	4
  MAX1329BETL+	36		72
  AD8616AR	2			8
  AG20P-5	500	                		                                    1000
  LP339M/NOPB	3			12
  LED                            3                                                    12
  ------------------------------------------------------------------------
  Total		                 34	72	1032  [mA]
  Please note that theoretical power consumption exceed maximum abilities of isolated DC/DC converters.
  In fact HV module will work on low power
- Project/Equipment
- Document
- Designer
- Drawn by
- Check.by
- Copyright WUT ISE 2020.
  This documentation describes Open Hardware and is licensed under the CERN OHL v.1.2. You may redistribute and modify this documentation under the terms of the CERN OHL v.1.2. (http://ohwr.org/CERNOHL). This documentation is distributed WITHOUT ANY EXPRESS OR IMPLIED WARRANTY, INCLUDING OF MERCHANTABILITY, SATISFACTORY QUALITY AND FITNESS FOR A PARTICULAR PURPOSE. Please see the CERN OHL v.1.2 for applicable conditions.
- Contact
- File
- Last Mod.
- Print Date
- Sheet
- Size
- A3
- of
- Rev
- (in symbol CTE3528-21_22UF_20V_10%) +

### Library data of the parts
C32-C35 C40-C43 = CC1808_330pF_6000V_10%_X7R_VISHAY_HV: Non-polarised capacitor; Part Description: SMD Multilayer Ceramic Chip Capacitor Solutions for High Voltage Applications; Manufacturer: VISHAY; Manufacturer Part Number: HV1808Y331KX6ATHV; TC: X7R; Tolerance: ±10%; Part Number: CC1808_330pF_6000V_10%_X7R_VISHAY_HV; Component Kind: Standard; Component Type: Standard; Pin Count: 2; Value: 330pF; Status: None; Case: 1808; Mounted: Yes; Socket: No; SMD: Yes; Sense: No; ComponentHeight: 2.7mm; HelpURL: \\cern.ch\dfs\Applications\Altium\Datasheets\CC1812_VISHAY_HV.pdf; Author: CERN DEM HF; CreateDate: 11.02.2022; LatestRevisionDate: 11.02.2022
C36-C39 = CC0805_4.7UF_50V_10%_X7R: Non-polarised capacitor; Part Description: SMD Multilayer Chip Ceramic Capacitor; Manufacturer: GENERIC; Manufacturer1 Part Number: C2012X7R1H475K125; Voltage: 50V; TC: X7R; Tolerance: ±10%; Part Number: CC0805_4.7UF_50V_10%_X7R; Component Kind: Standard; Component Type: Standard; Pin Count: 2; Value: 4.7uF; Status: Preferred; Manufacturer Part Number: CC0805_4.7UF_50V_10%_X7R; Case: 0805; Mounted: Yes; Socket: No; SMD: Yes; Sense: No; Manufacturer1 Example: TDK; Manufacturer1 ComponentHeight: 1.45mm; HelpURL: \\cern.ch\dfs\Applications\Altium\Datasheets\CC0805_X7R_TDK_C.pdf; Author: CERN DEM JMW; CreateDate: 30.07.2021; LatestRevisionDate: 30.07.2021
C47 C69 C70 C72 = CC0603_10UF_16V_20%_X5R: Non-polarised capacitor; Part Description: SMD Multilayer Chip Ceramic Capacitor; Manufacturer: GENERIC; Manufacturer1 Part Number: GRM188R61C106MA73D; Voltage: 16V; TC: X5R; Tolerance: ±20%; Part Number: CC0603_10UF_16V_20%_X5R; Component Kind: Standard; Component Type: Standard; Pin Count: 2; Value: 10uF; Status: None; Manufacturer Part Number: CC0603_10UF_16V_20%_X5R; Case: 0603; Mounted: Yes; Socket: No; SMD: Yes; Sense: No; Manufacturer1 Example: MURATA; Manufacturer1 ComponentHeight: 0.8mm; HelpURL: \\cern.ch\dfs\Applications\Altium\Datasheets\CC0603_X5R_MURATA_GRM.pdf; Author: CERN DEM MR; CreateDate: 02.03.2016; LatestRevisionDate: 02.03.2016
C56 = CTE3528-21_22UF_20V_10%: as C26 on sheet HV_PWR_STAGE; Part Number: CTE3528-21_22UF_20V_10%; Component Kind: Standard; Component Type: Standard; Pin Count: 2; Value: 22uF; Status: Preferred; Manufacturer Part Number: CTE3528-21_22UF_20V_10%; Case: B; Mounted: Yes; Socket: No; SMD: Yes; Sense: No; Manufacturer1 Example: AVX; Manufacturer1 ComponentHeight: 2.1mm; HelpURL: \\cern.ch\dfs\Applications\Altium\Datasheets\CTE_AVX_TAJ.pdf; Author: CERN DEM JLC; CreateDate: 03/12/2007; LatestRevisionDate: 03/12/2007
C57 C66 C68 C71 = CC0402_1UF_16V_10%_X5R: Non-polarised capacitor; Part Description: SMD Multilayer Chip Ceramic Capacitor; Manufacturer: GENERIC; Manufacturer1 Part Number: C1005X5R1C105KT; Voltage: 16V; TC: X5R; Tolerance: ±10%; Part Number: CC0402_1UF_16V_10%_X5R; Component Kind: Standard; Component Type: Standard; Pin Count: 2; Value: 1uF; Status: Preferred; Manufacturer Part Number: CC0402_1UF_16V_10%_X5R; Case: 0402; Mounted: Yes; Socket: No; SMD: Yes; Sense: No; Manufacturer1 Example: TDK; Manufacturer1 ComponentHeight: 0.55mm; HelpURL: \\cern.ch\dfs\Applications\Altium\Datasheets\CC0402_X5R_TDK_C.pdf; Author: CERN DEM JLC; CreateDate: 2012-10-25; LatestRevisionDate: 2012-10-25
IC2 IC3 = PM_TC7660: 20mA PUMP DC-TO-DC VOLTAGE CONVERTER
IC16 = REM5E-1205S/R10/A: RECOM, RP Series, Single Output DCDC Converter; Part Description: 12VDC to +5V (+1A), 5W Regulated DC-DC Converter; PressFit: No; Bonding: No; Part Number: REM5E-1205S/R10/A; Component Kind: Standard; Component Type: Standard; Device: REM5E-1205S/R10/A; PackageDescription: REM5E-XXXXS Series, Body 31.8x20.3mm, DIP-24 Package; Manufacturer: RECOM; Manufacturer Part Number: REM5E-1205S/R10/A; Pin Count: 6; Mounted: Yes; Socket: No; SMD: No; Sense: No; ComponentHeight: 10.2mm; HelpURL: \\cern.ch\dfs\Applications\Altium\Datasheets\RECOM_REM5E-XXXXS.pdf; Author: CERN DEM HF; CreateDate: 08.02.2022; LatestRevisionDate: 08.02.2022
IC17 = REM5E-0505S/R10/A: RECOM, RP Series, Single Output DCDC Converter; Part Description: 5VDC to +5V (+1A), 5W Regulated DC-DC Converter; PressFit: No; Bonding: No; Part Number: REM5E-0505S/R10/A; Component Kind: Standard; Component Type: Standard; Device: REM5E-0505S/R10/A; PackageDescription: REM5E-XXXXS Series, Body 31.8x20.3mm, DIP-24 Package; Manufacturer: RECOM; Manufacturer Part Number: REM5E-0505S/R10/A; Pin Count: 6; Mounted: Yes; Socket: No; SMD: No; Sense: No; ComponentHeight: 10.2mm; HelpURL: \\cern.ch\dfs\Applications\Altium\Datasheets\RECOM_REM5E-XXXXS.pdf; Author: CERN DEM HF; CreateDate: 08.02.2022; LatestRevisionDate: 08.02.2022
IC20 = NCP703SN33T1G: 3.3V 300mA, Ultra-Low Quiescent Current, IQ 12uA, Ultra-Low Noise, LDO Voltage Regulator; Manufacturer: ON SEMICONDUCTOR; PressFit: No; Bonding: No; Part Number: NCP703SN33T1G; Component Kind: Standard; Component Type: Standard; Device: NCP703SN33T1G; PackageDescription: SOT, 0.95mm Pitch; 5 Pin, 1.50mm W X 3.00mm L X 1.10mm H Body, IPC Medium Density; Part Description: 3.3V 300mA, Ultra-Low Quiescent Current, IQ 12uA, Ultra-Low Noise, LDO Voltage Regulator; Manufacturer Part Number: NCP703SN33T1G; Pin Count: 5; Case: SOT23-5; Mounted: Yes; Socket: No; SMD: Yes; Sense: No; ComponentHeight: 1.1mm; HelpURL: \\cern.ch\dfs\Applications\Altium\Datasheets\NCP703SN33T1G.pdf; Author: CERN DEM JLC; CreateDate: 16.02.2017; LatestRevisionDate: 16.02.2017
L2 = IND_250UH_50%_WURTH_WE-SL2-744224: Inductor Common Mode; Part Description: Common Mode SMD Line Filter (WE-SL2 Series); Manufacturer: WURTH ELEKTRONIK; Manufacturer Part Number: 744224; Power: 1.2A; Resistance: 0.13R; Tolerance: ±50%; Part Number: IND_250UH_50%_WURTH_WE-SL2-744224; Component Kind: Standard; Component Type: Standard; Pin Count: 4; Value: 2x250uH; Mounted: Yes; Socket: No; SMD: Yes; Sense: No; ComponentHeight: 5.3mm; HelpURL: \\cern.ch\dfs\Applications\Altium\Datasheets\IND_WURTH_WE-SL2_744224.pdf; Author: CERN DEM JLC; CreateDate: 02.12.2009; LatestRevisionDate: 15.10.2012
L3 L4 = IND_10UH_20%_BOURNS_PM43: as L1 on sheet HV_PWR_STAGE; Part Number: IND_10UH_20%_BOURNS_PM43; Component Kind: Standard; Component Type: Standard; Pin Count: 2; Value: 10uH; Status: None; Mounted: Yes; Socket: No; SMD: Yes; Sense: No; ComponentHeight: 3.5mm; HelpURL: \\cern.ch\dfs\Applications\Altium\Datasheets\IND_BOURNS_PM43.pdf; Author: CERN DEM JLC; CreateDate: 17/05/2011; LatestRevisionDate: 17/05/2011

## Sheet LED_indicators.SchDoc: HV_Module
size 420 x 297 mm; EDA_Number: ARTIQ; Projet: HV_Module; Author: G.Kasprowicz; CompanyName: WUT ISE; DrawnBy: G.Kasprowicz; Organization: WUT ISE; Address1: PW ISE; Address2: Nowowiejska 15/19 00-665 Warsaw; Address3: gkasprow@gmail.com; DocumentNumber: 6; Revision: 1.0; SheetNumber: 6; SheetTotal: 6; ModifiedBy: -; CheckedDate: -; Title2: LED_Indicators; DivGrp: WUT ISE; Designer: G.Kasprowicz; ModifiedDate: -; ProjectName: Sensor Box
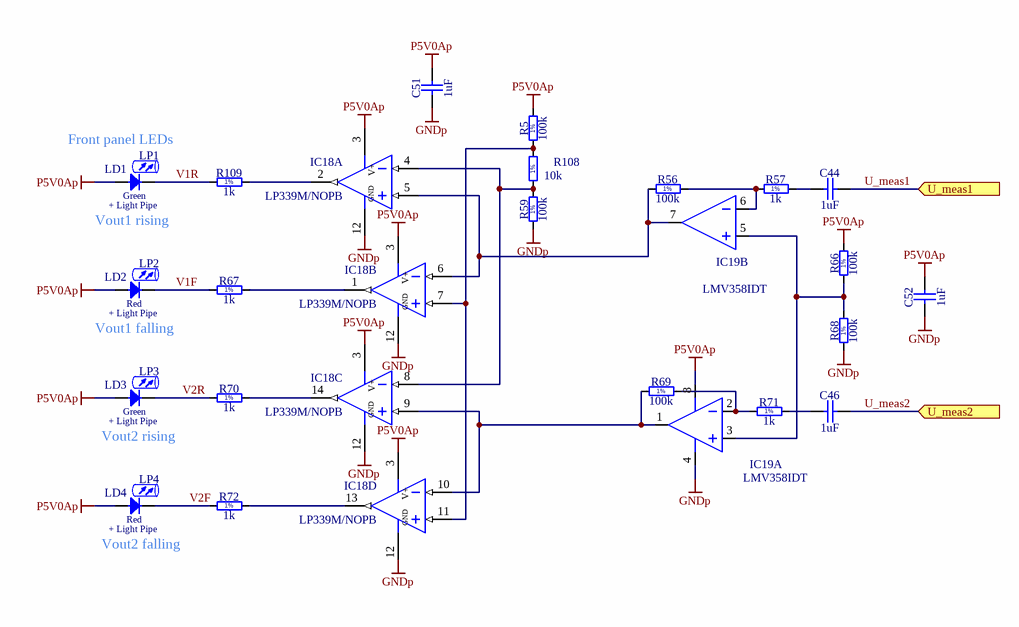
[diagram p5: LED_indicators.SchDoc]

### Parts
C44  1uF  [CAPC1005X55N]
C46  1uF  [CAPC1005X55N]
C51  1uF  [CAPC1005X55N]
C52  1uF  [CAPC1005X55N]
IC18  LP339M/NOPB  [SOIC127P600X175-14N]  (parts A,B,C,D of 4)
IC19  LMV358IDT  [SO-8]  (parts A,B of 2)
LD1  Green  [LED_DIALIGHT_555-230]
LD2  Red  [LED_DIALIGHT_555-200]
LD3  Green  [LED_DIALIGHT_555-230]
LD4  Red  [LED_DIALIGHT_555-200]
LP1  (no value)  [LEDLP_BIVAR_PLP2-1200]
LP2  (no value)  [LEDLP_BIVAR_PLP2-1200]
LP3  (no value)  [LEDLP_BIVAR_PLP2-1200]
LP4  (no value)  [LEDLP_BIVAR_PLP2-1200]
R5  100k  [RESC1608X55N]
R56  100k  [RESC1608X55N]
R57  1k  [RESC1005X40N]
R59  100k  [RESC1608X55N]
R66  100k  [RESC1608X55N]
R67  1k  [RESC1005X40N]
R68  100k  [RESC1608X55N]
R69  100k  [RESC1608X55N]
R70  1k  [RESC1005X40N]
R71  1k  [RESC1005X40N]
R72  1k  [RESC1005X40N]
R108  10k  [RESC1005X40N]
R109  1k  [RESC1005X40N]

### Ports
U_meas1 (in), U_meas2 (in)

### Nets
GNDp: C51.1 C52.1 IC18.12(GND) IC19.4(V-) R59.1 R68.1
P5V0Ap: C51.2 C52.2 IC18.3(V+) IC19.8(V+) LD1.2(A) LD2.2(A) LD3.2(A) LD4.2(A) R5.2 R66.2
U_meas1: C44.2 ; port U_meas1
U_meas2: C46.2 ; port U_meas2
V1F: LD2.1(C) R67.1
V1R: LD1.1(C) R109.1
V2F: LD4.1(C) R72.1
V2R: LD3.1(C) R70.1
NetC44_1: C44.1 R57.2
NetC46_1: C46.1 R71.2
NetIC18_1: IC18.1(OUT) R67.2
NetIC18_2: IC18.2(OUT) R109.2
NetIC18_4: IC18.4(IN-) IC18.8(IN-) R59.2 R108.1
NetIC18_5: IC18.5(IN+) IC18.6(IN-) IC19.7(OUT) R56.1
NetIC18_7: IC18.7(IN+) IC18.11(IN+) R5.1 R108.2
NetIC18_9: IC18.9(IN+) IC18.10(IN-) IC19.1(OUT) R69.1
NetIC18_13: IC18.13(OUT) R72.2
NetIC18_14: IC18.14(OUT) R70.2
NetIC19_2: IC19.2(IN-) R69.2 R71.1
NetIC19_3: IC19.3(IN+) IC19.5(IN+) R66.1 R68.2
NetIC19_6: IC19.6(IN-) R56.2 R57.1

### Notes on the sheet
- Front panel LEDs
- Vout1 rising
- Vout1 falling
- Vout2 rising
- Vout2 falling
- Project/Equipment
- Document
- Designer
- Drawn by
- Check.by
- Copyright WUT ISE 2020.
  This documentation describes Open Hardware and is licensed under the CERN OHL v.1.2. You may redistribute and modify this documentation under the terms of the CERN OHL v.1.2. (http://ohwr.org/CERNOHL). This documentation is distributed WITHOUT ANY EXPRESS OR IMPLIED WARRANTY, INCLUDING OF MERCHANTABILITY, SATISFACTORY QUALITY AND FITNESS FOR A PARTICULAR PURPOSE. Please see the CERN OHL v.1.2 for applicable conditions.
- Contact
- File
- Last Mod.
- Print Date
- Sheet
- Size
- A3
- of
- Rev
- (in symbol LEDLP_BIVAR_PLP2-1200) + Light Pipe
- (in symbol R0402_1K_1%_0.0625W_100PPM) 1%
- (in symbol R0402_10K_1%_0.0625W_100PPM) 1%
- (in symbol R0603_100K_1%_0.1W_100PPM) 1%

### Library data of the parts
C44 C46 C51 C52 = CC0402_1UF_16V_10%_X5R: as C57 on sheet Supply_5V_ISOL; Part Number: CC0402_1UF_16V_10%_X5R; Component Kind: Standard; Component Type: Standard; Pin Count: 2; Value: 1uF; Status: Preferred; Manufacturer Part Number: CC0402_1UF_16V_10%_X5R; Case: 0402; Mounted: Yes; Socket: No; SMD: Yes; Sense: No; Manufacturer1 Example: TDK; Manufacturer1 ComponentHeight: 0.55mm; HelpURL: \\cern.ch\dfs\Applications\Altium\Datasheets\CC0402_X5R_TDK_C.pdf; Author: CERN DEM JLC; CreateDate: 2012-10-25; LatestRevisionDate: 2012-10-25
IC18 = LP339M/NOPB: Quad Operational Amplifier; Part Description: Ultra-Low Power Quad Comparator; Manufacturer: TEXAS INSTRUMENTS; PressFit: No; Bonding: No; Part Number: LP339M/NOPB; Component Kind: Standard; Component Type: Standard; Device: LP339M/NOPB; PackageDescription: SOIC 14, Pitch 1.27mm - Body 4x8.75mm, IPC Medium Density; Manufacturer Part Number: LP339M/NOPB; Pin Count: 14; Case: SOIC14; Mounted: Yes; Socket: No; SMD: Yes; Sense: No; ComponentHeight: 1.75mm; Author: CERN DEM MR; HelpURL: \\cern.ch\dfs\Applications\Altium\Datasheets\LP339M-NOPB.pdf; CreateDate: 23.03.2016; LatestRevisionDate: 23.03.2016
IC19 = OA_LMV358: Low voltage, Rail-to_Rail output Operational Amplifier
LD1 LD3 = LED_DIALIGHT_555-2301F: LED Green 1C 2A; Part Description: Single 2mm Green LED CBI® Circuit Board Indicator; PressFit: No; Bonding: No; Part Number: LED_DIALIGHT_555-2301F; Component Kind: Standard; Component Type: Standard; Color: Green; PackageDescription: Single 2mm Green LED, Body 5.08x2.54mm, Pin spacing 2.54mm; Manufacturer: DIALIGHT; Manufacturer Part Number: 555-2301F; Pin Count: 2; Mounted: Yes; Socket: No; SMD: No; Sense: No; ComponentHeight: 6.35mm; HelpURL: \\cern.ch\dfs\Applications\Altium\Datasheets\LED_DIALIGHT_555-2301F.pdf; Author: CERN DEM JMW; CreateDate: 22.09.2008; LatestRevisionDate: 17.03.2010
LD2 LD4 = LED_DIALIGHT_555-2001F: LED Red 1C 2A; Part Description: Single 2mm Red LED CBI® Circuit Board Indicator; PressFit: No; Bonding: No; Part Number: LED_DIALIGHT_555-2001F; Component Kind: Standard; Component Type: Standard; Color: Red; PackageDescription: Single 2mm Red LED, Body 5.08x2.54mm, Pin spacing 2.54mm; Manufacturer: DIALIGHT; Manufacturer Part Number: 555-2001F; Pin Count: 2; Mounted: Yes; Socket: No; SMD: No; Sense: No; ComponentHeight: 6.35mm; HelpURL: \\cern.ch\dfs\Applications\Altium\Datasheets\LED_DIALIGHT_555-2001F.pdf; Author: CERN DEM JMW; CreateDate: 22.09.2008; LatestRevisionDate: 17.03.2010
LP1-LP4 = LEDLP_BIVAR_PLP2-1200: LED Light Pipe x1 Type1; Part Description: 3mm Dome Leens, Single Station Vertivcal Round Lightpipe Height 1.2 in. (30.5mm); Manufacturer: BIVAR; PressFit: No; Bonding: No; Part Number: LEDLP_BIVAR_PLP2-1200; Component Kind: Accessories; Component Type: Standard; PackageDescription: 3mm Dome Leens, Single Station Vertivcal Round Lightpipe Height 1.2 in. (30.5mm); Manufacturer Part Number: PLP2-1200; Pin Count: 0; Mounted: Yes; Socket: No; SMD: No; Sense: No; ComponentHeight: 31.3mm; HelpURL: \\cern.ch\dfs\Applications\Altium\Datasheets\LEDLP_BIVAR_PLP2-1200.pdf; Author: CERN DEM HF; CreateDate: 09.02.2022; LatestRevisionDate: 09.02.2022
R5 R56 R59 R66 R68 R69 = R0603_100K_1%_0.1W_100PPM: as R77 on sheet HV_PWR_STAGE; Part Number: R0603_100K_1%_0.1W_100PPM; Component Kind: Standard; Component Type: Standard; Pin Count: 2; Value: 100k; Status: Preferred; Tolerance: ±1%; Manufacturer Part Number: R0603_100K_1%_0.1W_100PPM; Case: 0603; Mounted: Yes; Sense: No; Socket: No; SMD: Yes; Manufacturer1 Example: NIC COMPONENT; Manufacturer1 ComponentHeight: 0.55mm; HelpURL: \\cern.ch\dfs\Applications\Altium\Datasheets\R0603_NIC_NRC.pdf; Author: CERN DEM JLC; CreateDate: 2007-12-03; LatestRevisionDate: 2008-03-13
R57 R67 R70-R72 R109 = R0402_1K_1%_0.0625W_100PPM: as R58 on sheet HV_PWR_STAGE; Part Number: R0402_1K_1%_0.0625W_100PPM; Component Kind: Standard; Component Type: Standard; Pin Count: 2; Value: 1k; Status: Not recommended; Power: 0.0625W; Tolerance: ±1%; Manufacturer Part Number: R0402_1K_1%_0.0625W_100PPM; Case: 0402; Mounted: Yes; Sense: No; Socket: No; SMD: Yes; Manufacturer1 Example: YAGEO PHYCOMP; Manufacturer1 ComponentHeight: 0.4mm; HelpURL: \\cern.ch\dfs\Applications\Altium\Datasheets\R0402_Phycomp_RC0402.pdf; Author: CERN DEM JLC; CreateDate: 2007-12-03; LatestRevisionDate: 2012-10-17
R108 = R0402_10K_1%_0.0625W_100PPM: as R107 on sheet Isolators_HV; Part Number: R0402_10K_1%_0.0625W_100PPM; Component Kind: Standard; Component Type: Standard; Pin Count: 2; Value: 10k; Status: Not recommended; Power: 0.0625W; Tolerance: ±1%; Manufacturer Part Number: R0402_10K_1%_0.0625W_100PPM; Case: 0402; Mounted: Yes; Sense: No; Socket: No; SMD: Yes; Manufacturer1 Example: YAGEO PHYCOMP; Manufacturer1 ComponentHeight: 0.4mm; HelpURL: \\cern.ch\dfs\Applications\Altium\Datasheets\R0402_Phycomp_RC0402.pdf; Author: CERN DEM JLC; CreateDate: 2007-12-03; LatestRevisionDate: 2012-10-17

## Nets that join several sheets
GND: HV_Module_2W (5 pins), Isolators_HV (30 pins), Supply_5V_ISOL (C36.1 L2.2)
GNDp: HV_Module_2W (5 pins), Isolators_HV (23 pins), U_ADC_DAC1 (16 pins), U_HV_PWR_STAGE1 (20 pins), Supply_5V_ISOL (15 pins), U_ADC_DAC2 (16 pins), U_HV_PWR_STAGE2 (20 pins), LED_indicators (6 pins)
N3V3p: U_HV_PWR_STAGE1 (6 pins), Supply_5V_ISOL (C70.2 IC2.5 IC3.5), U_HV_PWR_STAGE2 (6 pins)
P3V3: HV_Module_2W (J1.11), Isolators_HV (15 pins)
P3V3Ap: U_ADC_DAC1 (C19A.2 C24A.2 IC15A.38), U_HV_PWR_STAGE1 (R75A.2), Supply_5V_ISOL (C57.2 L4.2), U_ADC_DAC2 (C19B.2 C24B.2 IC15B.38), U_HV_PWR_STAGE2 (R75B.2)
P3V3p: Isolators_HV (16 pins), Supply_5V_ISOL (7 pins)
P5V0Ap: HV_Module_2W (C53.1 C54.2 IC21.2), U_HV_PWR_STAGE1 (9 pins), Supply_5V_ISOL (5 pins), U_HV_PWR_STAGE2 (9 pins), LED_indicators (10 pins)
P12V0: HV_Module_2W (J1.6 J1.8 J1.10), Supply_5V_ISOL (C36.2 L2.1)
ADC_I: U_ADC_DAC1 (IC15A.30), U_HV_PWR_STAGE1 (C23A.2 R94A.1)
ADC_I: U_ADC_DAC2 (IC15B.30), U_HV_PWR_STAGE2 (C23B.2 R94B.1)
CSN: HV_Module_2W (J1.5), Isolators_HV (R99.2)
CSN_ISOL: Isolators_HV (IC24.8), U_ADC_DAC1 (IC15A.8)
CSN_ISOL: U_ADC_DAC1 (IC15A.14), U_ADC_DAC2 (IC15B.8)
DAC_I: U_ADC_DAC1 (IC15A.23 R27A.2), U_HV_PWR_STAGE1 (R58A.2)
DAC_I: U_ADC_DAC2 (IC15B.23 R27B.2), U_HV_PWR_STAGE2 (R58B.2)
DAC_U: U_ADC_DAC1 (IC15A.24 R25A.2), U_HV_PWR_STAGE1 (R82A.2)
DAC_U: U_ADC_DAC2 (IC15B.24 R25B.2), U_HV_PWR_STAGE2 (R82B.2)
ENBL: Isolators_HV (IC27.2), U_HV_PWR_STAGE1 (IC22A.2), U_HV_PWR_STAGE2 (IC22B.2)
ENBLn1: U_ADC_DAC1 (IC15A.1), U_HV_PWR_STAGE1 (IC22A.1 R75A.1)
ENBLn2: U_ADC_DAC2 (IC15B.1), U_HV_PWR_STAGE2 (IC22B.1 R75B.1)
EXT_SCKI_ISOL: U_ADC_DAC1 (IC15A.13), U_ADC_DAC2 (IC15B.6)
EXT_SDI_ISOL: U_ADC_DAC1 (IC15A.12), U_ADC_DAC2 (IC15B.7)
EXT_SDO_ISOL: U_ADC_DAC1 (IC15A.11), U_ADC_DAC2 (IC15B.5)
HV_EN: HV_Module_2W (J1.15), Isolators_HV (IC28.1)
HV_OUT: HV_Module_2W (J7.1), U_HV_PWR_STAGE1 (R61A.2 R73A.2)
HV_OUT: HV_Module_2W (J4.1), U_HV_PWR_STAGE2 (R61B.2 R73B.2)
INT0: HV_Module_2W (J1.9), Isolators_HV (IC28.4)
INT0_ISOLn: Isolators_HV (IC27.3 R107.1), U_ADC_DAC1 (T12A.3), U_ADC_DAC2 (T12B.3)
REFIN: HV_Module_2W (C55.2 IC21.6), U_ADC_DAC1 (R20A.2 R22A.2), U_ADC_DAC2 (R20B.2 R22B.2)
SCKI: HV_Module_2W (J1.7), Isolators_HV (R95.2)
SCKI_ISOL: Isolators_HV (IC23.8), U_ADC_DAC1 (IC15A.6)
SDI: HV_Module_2W (J1.1), Isolators_HV (R2.2)
SDI_ISOL: Isolators_HV (IC1.8), U_ADC_DAC1 (IC15A.7)
SDO: HV_Module_2W (J1.3), Isolators_HV (IC25.8)
SDO_ISOL: Isolators_HV (R103.2), U_ADC_DAC1 (IC15A.5)
U_meas1: U_ADC_DAC1 (IC15A.31), U_HV_PWR_STAGE1 (C16A.2 R84A.1), LED_indicators (C44.2)
U_meas2: U_ADC_DAC2 (IC15B.31), U_HV_PWR_STAGE2 (C16B.2 R84B.1), LED_indicators (C46.2)

## Assembly variants
HV_POS: not fitted R30A R30B R89A R89B
HV_NEG: not fitted R63A R63B R80A R80B
HV_POS_NEG: not fitted R30A R63B R80B R89A